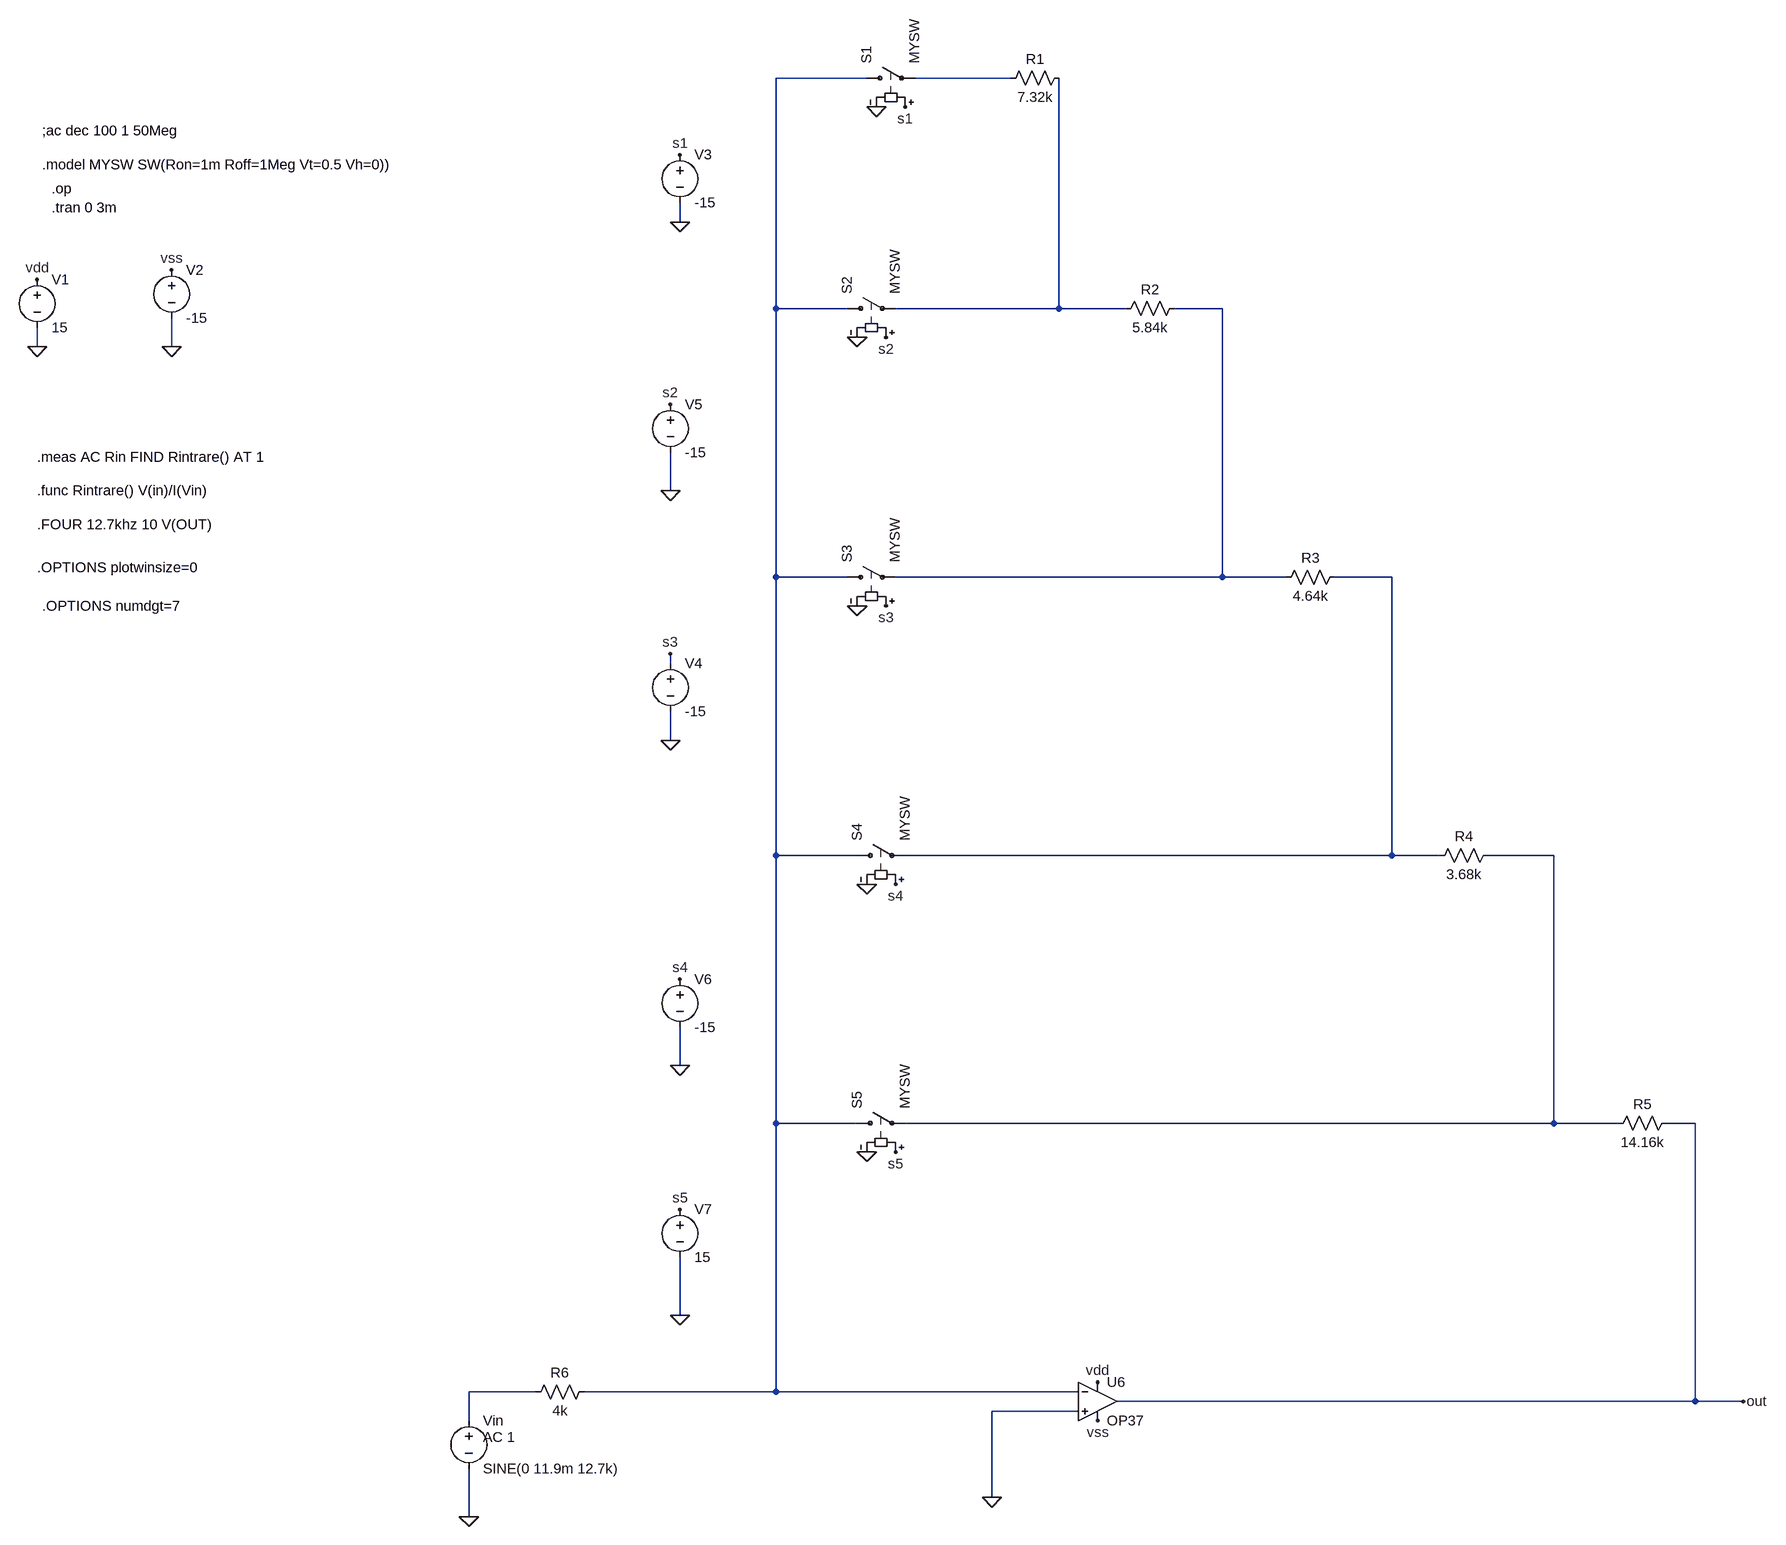
[diagram p0: schematic pga.asc]
pga.asc, the LTspice schematic file:
Version 4
SHEET 1 880 888
WIRE -1808 -5536 -2096 -5536
WIRE -1504 -5536 -1728 -5536
WIRE -2256 -5296 -2256 -5328
WIRE -2096 -5152 -2096 -5536
WIRE -1840 -5152 -2096 -5152
WIRE -1424 -5152 -1424 -5536
WIRE -1424 -5152 -1760 -5152
WIRE -1312 -5152 -1424 -5152
WIRE -1152 -5152 -1232 -5152
WIRE -3616 -5088 -3616 -5120
WIRE -3392 -5088 -3392 -5136
WIRE -2272 -4848 -2272 -4912
WIRE -2096 -4704 -2096 -5152
WIRE -1840 -4704 -2096 -4704
WIRE -1152 -4704 -1152 -5152
WIRE -1152 -4704 -1760 -4704
WIRE -1040 -4704 -1152 -4704
WIRE -864 -4704 -960 -4704
WIRE -2272 -4560 -2272 -4576
WIRE -2272 -4432 -2272 -4480
WIRE -2096 -4240 -2096 -4704
WIRE -1824 -4240 -2096 -4240
WIRE -864 -4240 -864 -4704
WIRE -864 -4240 -1744 -4240
WIRE -784 -4240 -864 -4240
WIRE -576 -4240 -704 -4240
WIRE -2256 -3888 -2256 -3952
WIRE -2096 -3792 -2096 -4240
WIRE -1824 -3792 -2096 -3792
WIRE -576 -3792 -576 -4240
WIRE -576 -3792 -1744 -3792
WIRE -368 -3792 -576 -3792
WIRE -240 -3792 -288 -3792
WIRE -2256 -3472 -2256 -3568
WIRE -2496 -3344 -2608 -3344
WIRE -2096 -3344 -2096 -3792
WIRE -2096 -3344 -2416 -3344
WIRE -1392 -3344 -2096 -3344
WIRE -240 -3328 -240 -3792
WIRE -240 -3328 -1328 -3328
WIRE -160 -3328 -240 -3328
WIRE -1392 -3312 -1536 -3312
WIRE -2608 -3296 -2608 -3344
WIRE -1536 -3168 -1536 -3312
WIRE -2608 -3136 -2608 -3216
FLAG -2608 -3136 0
FLAG -3616 -5088 0
FLAG -3392 -5088 0
FLAG -3392 -5216 vss
FLAG -3616 -5200 vdd
FLAG -2256 -5296 0
FLAG -2256 -3888 0
FLAG -2256 -3472 0
FLAG -2272 -4848 0
FLAG -2256 -5408 s1
FLAG -2272 -4992 s2
FLAG -2272 -4576 s3
FLAG -2256 -4032 s4
FLAG -2256 -3648 s5
FLAG -160 -3328 out
FLAG -1360 -3360 vdd
FLAG -1360 -3296 vss
FLAG -2272 -4432 0
FLAG -1536 -3168 0
FLAG -1792 -5488 0
FLAG -1744 -5488 s1
FLAG -1824 -5104 0
FLAG -1776 -5104 s2
FLAG -1824 -4656 0
FLAG -1776 -4656 s3
FLAG -1808 -4192 0
FLAG -1760 -4192 s4
FLAG -1808 -3744 0
FLAG -1760 -3744 s5
DATAFLAG -240 -3328 ""
SYMBOL res -1408 -5552 R90
WINDOW 0 0 56 VBottom 2
WINDOW 3 32 56 VTop 2
SYMATTR InstName R1
SYMATTR Value 7.32k
SYMBOL res -1216 -5168 R90
WINDOW 0 0 56 VBottom 2
WINDOW 3 32 56 VTop 2
SYMATTR InstName R2
SYMATTR Value 5.84k
SYMBOL res -944 -4720 R90
WINDOW 0 0 56 VBottom 2
WINDOW 3 32 56 VTop 2
SYMATTR InstName R3
SYMATTR Value 4.64k
SYMBOL res -688 -4256 R90
WINDOW 0 0 56 VBottom 2
WINDOW 3 32 56 VTop 2
SYMATTR InstName R4
SYMATTR Value 3.68k
SYMBOL res -272 -3808 R90
WINDOW 0 0 56 VBottom 2
WINDOW 3 32 56 VTop 2
SYMATTR InstName R5
SYMATTR Value 14.16k
SYMBOL res -2400 -3360 R90
WINDOW 0 0 56 VBottom 2
WINDOW 3 32 56 VTop 2
SYMATTR InstName R6
SYMATTR Value 4k
SYMBOL voltage -2608 -3312 R0
WINDOW 123 24 44 Left 2
WINDOW 39 0 0 Left 0
SYMATTR Value2 AC 1
SYMATTR InstName Vin
SYMATTR Value SINE(0 11.9m 12.7k)
SYMBOL voltage -3616 -5216 R0
WINDOW 123 0 0 Left 0
WINDOW 39 0 0 Left 0
SYMATTR InstName V1
SYMATTR Value 15
SYMBOL voltage -3392 -5232 R0
WINDOW 123 0 0 Left 0
WINDOW 39 0 0 Left 0
SYMATTR InstName V2
SYMATTR Value -15
SYMBOL voltage -2256 -5424 R0
WINDOW 123 0 0 Left 0
WINDOW 39 0 0 Left 0
SYMATTR InstName V3
SYMATTR Value -15
SYMBOL voltage -2272 -4576 R0
WINDOW 123 0 0 Left 0
WINDOW 39 0 0 Left 0
SYMATTR InstName V4
SYMATTR Value -15
SYMBOL voltage -2272 -5008 R0
WINDOW 123 0 0 Left 0
WINDOW 39 0 0 Left 0
SYMATTR InstName V5
SYMATTR Value -15
SYMBOL voltage -2256 -4048 R0
WINDOW 123 0 0 Left 0
WINDOW 39 0 0 Left 0
SYMATTR InstName V6
SYMATTR Value -15
SYMBOL voltage -2256 -3664 R0
WINDOW 123 0 0 Left 0
WINDOW 39 0 0 Left 0
SYMATTR InstName V7
SYMATTR Value 15
SYMBOL OpAmps\\OP37 -1360 -3392 R0
SYMATTR InstName U6
SYMBOL sw -1824 -5536 R270
SYMATTR InstName S1
SYMATTR Value MYSW
SYMBOL sw -1856 -5152 R270
SYMATTR InstName S2
SYMATTR Value MYSW
SYMBOL sw -1856 -4704 R270
SYMATTR InstName S3
SYMATTR Value MYSW
SYMBOL sw -1840 -4240 R270
SYMATTR InstName S4
SYMATTR Value MYSW
SYMBOL sw -1840 -3792 R270
SYMATTR InstName S5
SYMATTR Value MYSW
TEXT -3608 -5448 Left 2 !;ac dec 100 1 50Meg
TEXT -3608 -5392 Left 2 !.model MYSW SW(Ron=1m Roff=1Meg Vt=0.5 Vh=0))
TEXT -3592 -5320 Left 2 !.tran 0 3m
TEXT -3592 -5352 Left 2 !.op
TEXT -3616 -4904 Left 2 !.meas AC Rin FIND Rintrare() AT 1
TEXT -3616 -4848 Left 2 !.func Rintrare() V(in)/I(Vin)
TEXT -3616 -4792 Left 2 !.FOUR 12.7khz 10 V(OUT)
TEXT -3616 -4720 Left 2 !.OPTIONS plotwinsize=0
TEXT -3608 -4656 Left 2 !.OPTIONS numdgt=7

The netlist it stands for:
* pga.asc
R1 N003 N002 7.32k
R2 N004 N003 5.84k
R3 N005 N004 4.64k
R4 N006 N005 3.68k
R5 out N006 14.16k
R6 N001 N007 4k
Vin N007 0 SINE(0 11.9m 12.7k) AC 1
V1 vdd 0 15
V2 vss 0 -15
V3 s1 0 -15
V4 s3 0 -15
V5 s2 0 -15
V6 s4 0 -15
V7 s5 0 15
XU6 0 N001 vdd vss out LT1037  ; OP37, pins In+ In- V+ V- OUT
S1 N001 N002 s1 0 MYSW
S2 N001 N003 s2 0 MYSW
S3 N001 N004 s3 0 MYSW
S4 N001 N005 s4 0 MYSW
S5 N001 N006 s5 0 MYSW
;ac dec 100 1 50Meg
.model MYSW SW(Ron=1m Roff=1Meg Vt=0.5 Vh=0))
.tran 0 3m
.op
.meas AC Rin FIND Rintrare() AT 1
.func Rintrare() V(in)/I(Vin)
.FOUR 12.7khz 10 V(OUT)
.OPTIONS plotwinsize=0
.OPTIONS numdgt=7
.lib LTC.lib
.backanno
.end